# EAGLE design mika (EAGLE 7.7.0)
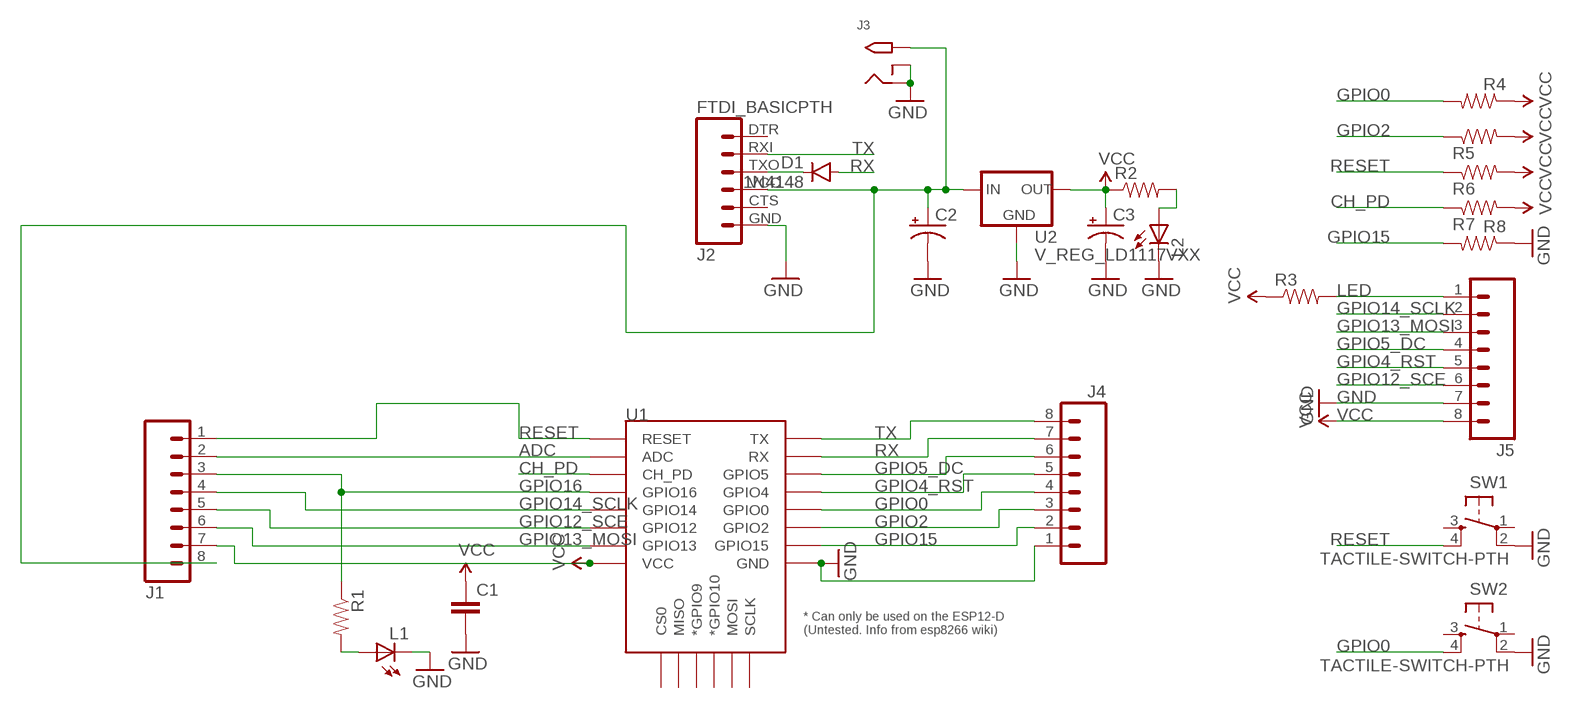
[diagram p0: schematic, sheet 1]

## Parts
C1  CAPKIT  [CAP-PTH-SMALL-KIT]
C2  CAP_POLPTH2  [CPOL-RADIAL-10UF-25V]
C3  CAP_POLPTH2  [CPOL-RADIAL-10UF-25V]
D1  1N4148  DIODE1N4148  [DIODE-1N4148]
J1  M083.5MM-8  [SCREWTERMINAL-3.5MM-8]
J2  FTDI_BASICPTH  [FTDI_BASIC]
J3  2.1MMJACKTHM  [PJ-102A]
J4  M083.5MM-8  [SCREWTERMINAL-3.5MM-8]
J5  M08  [1X08_ROUND]
L1  LED5MM  [LED5MM]
L2  LED5MM  [LED5MM]
R1  RESISTORKIT  [AXIAL-0.3-KIT]
R2  RESISTORKIT  [AXIAL-0.3-KIT]
R3  RESISTORKIT  [AXIAL-0.3-KIT]
R4  RESISTORKIT  [AXIAL-0.3-KIT]
R5  RESISTORKIT  [AXIAL-0.3-KIT]
R6  RESISTORKIT  [AXIAL-0.3-KIT]
R7  RESISTORKIT  [AXIAL-0.3-KIT]
R8  RESISTORKIT  [AXIAL-0.3-KIT]
SW1  TACTILE-SWITCH-PTH  [TAC-SWITCH-PTH]
SW2  TACTILE-SWITCH-PTH  [TAC-SWITCH-PTH]
U1  ESP12ESMD  [ESP12E-SMD]
U2  V_REG_LD1117VXX  [78XXL]

## Nets
ADC: J1.2 U1.ADC
CH_PD: R7.P$1 U1.CH_PD
GND: C1.2 C2.2(-) C3.2(-) J2.GND J3.RING J3.RING_SW J4.1 J5.7 L1.K(C) L2.K(C) R8.P$1 SW1.2 SW2.2 U1.GND U2.GND
GPIO0: J4.4 R4.P$2 SW2.4 U1.GPIO0
GPIO2: J4.3 R5.P$1 U1.GPIO2
GPIO4_RST: J4.5 J5.5 U1.GPIO4
GPIO5_DC: J4.6 J5.4 U1.GPIO5
GPIO12_SCE: J1.5 J5.6 U1.GPIO12
GPIO13_MOSI: J1.6 J5.3 U1.GPIO13
GPIO14_SCLK: J1.4 J5.2 U1.GPIO14
GPIO15: J4.2 R8.P$2 U1.GPIO15
GPIO16: J1.3 R1.P$1 U1.GPIO16
LED: J5.1 R3.P$2
N$1: D1.C J2.TXO
N$2: C2.1(+) J1.8 J2.VCC J3.TIP U2.IN
N$3: L2.A R2.P$2
N$4: L1.A R1.P$2
RESET: J1.1 R6.P$1 SW1.4 U1.RESET
RX: D1.A J4.7 U1.RXD0(RX)
TX: J2.RXI J4.8 U1.TXD0(TX)
VCC: C1.1 C3.1(+) J1.7 J5.8 R2.P$1 R3.P$1 R4.P$1 R5.P$2 R6.P$2 R7.P$2 U1.VCC U2.OUT
Unconnected: J2.CTS J2.DTR SW1.1 SW1.3 SW2.1 SW2.3 U1.CS0 U1.GPIO9(*GPIO9) U1.GPIO10(*GPIO10) U1.MISO U1.MOSI U1.SCLK

## Library data of the parts
C1 = SparkFun-Capacitors:CAP: Capacitor Standard 0603 ceramic capacitor, and 0.1" leaded capacitor.
C2 C3 = SparkFun-Passives:CAP_POL: Capacitor Polarized These are standard SMD and PTH capacitors. Normally 10uF, 47uF, and 100uF in electrolytic and tantalum varieties. Always verify the external diameter of the through hole cap, it varies with capacity, voltage, and manufacturer. The EIA devices should be standard.
D1 = SparkFun-DiscreteSemi:DIODE: Diode These are standard reverse protection diodes and small signal diodes. SMA package can handle up to about 1A. SOD-323 can handle about 200mA. What the SOD-323 package when ordering, there are some mfgs out there that are 5-pin packages.; PROD_ID: DIO-08378
J1 J4 = SparkFun-Connectors:M08: Header 8 Standard 8-pin 0.1" header. Use with straight break away headers (SKU : PRT-00116), right angle break away headers (PRT-00553), swiss pins (PRT-00743), machine pins (PRT-00117), and female headers (PRT-00115).
J2 = SparkFun-Connectors:FTDI_BASIC: FTDI Basic header with labels
J3 = adafruit:2.1MMJACK: 2.1mm x 5.5mm THM DC jack with internal switch. Digikey part #PJ-102A, 4UCON part #05537 2.1mm x 5.5mm SMT DC jack with internal switch. Digikey part #PJ-002A-SMT, 4UCON part #03267 By microbuilder.eu & adafruit.com
J5 = SparkFun-Connectors:M08: Header 8 Standard 8-pin 0.1" header. Use with straight break away headers (SKU : PRT-00116), right angle break away headers (PRT-00553), swiss pins (PRT-00743), machine pins (PRT-00117), and female headers (PRT-00115).; PROD_ID: CONN-08437
L1 L2 = adafruit:LED: LED OSRAM: - CHIPLED LG R971, LG N971, LY N971, LG Q971, LY Q971, LO R971, LY R971 LH N974, LH R974 LS Q976, LO Q976, LY Q976 LO Q996 - Hyper CHIPLED LW Q18S LB Q993, LB Q99A, LB R99A - SideLED LS A670, LO A670, LY A670, LG A670, LP A670 LB A673, LV A673, LT A673, LW A673 LH A674 LY A675 LS A676, LA A676, LO A676, LY A676, LW A676 LS A679, LY A679, LG A679 - Hyper Micro SIDELED® LS Y876, LA Y876, LO Y876, LY Y876 LT Y87S - SmartLED LW L88C, LW L88S LB L89C, LB L89S, LG L890 LS L89K, LO L89K, LY L89K LS L896, LA L896, LO L896, LY L896 - TOPLED LS T670, LO T670, LY T670, LG T670, LP T670 LSG T670, LSP T670, LSY T670, LOP T670, LYG T670 LG T671, LOG T671, LSG T671 LB T673, LV T673, LT T673, LW T673 LH T674 LS T676, LA T676, LO T676, LY T676, LB T676, LH T676, LSB T676, LW T676 LB T67C, LV T67C, LT T67C, LS T67K, LO T67K, LY T67K, LW E67C LS E67B, LA E67B, LO E67B, LY E67B, LB E67C, LV E67C, LT E67C LW T67C LS T679, LY T679, LG T679 LS T770, LO T770, LY T770, LG T770, LP T770 LB T773, LV T773, LT T773, LW T773 LH T774 LS E675, LA E675, LY E675, LS T675 LS T776, LA T776, LO T776, LY T776, LB T776 LHGB T686 LT T68C, LB T68C - Hyper Mini TOPLED® LB M676 - Mini TOPLED Santana® LG M470 LS M47K, LO M47K, LY M47K Source: http://www.osram.convergy.de/
R1-R8 = SparkFun-Resistors:RESISTOR: Resistor Basic schematic elements and footprints for 0603, 1206, and PTH resistors.
SW1 SW2 = GeekAmmo:TACTILE-SWITCH: Tactile Switch 4 Pins, SPST NO
U1 = esp8266modules:ESP12E: ESP12E Module
U2 = SparkFun-PowerIC:V_REG_LD1117VXX: LD1117VXX voltage regulator. We carry the 3.3V version (COM-00526) in TO-220 package.

## Board
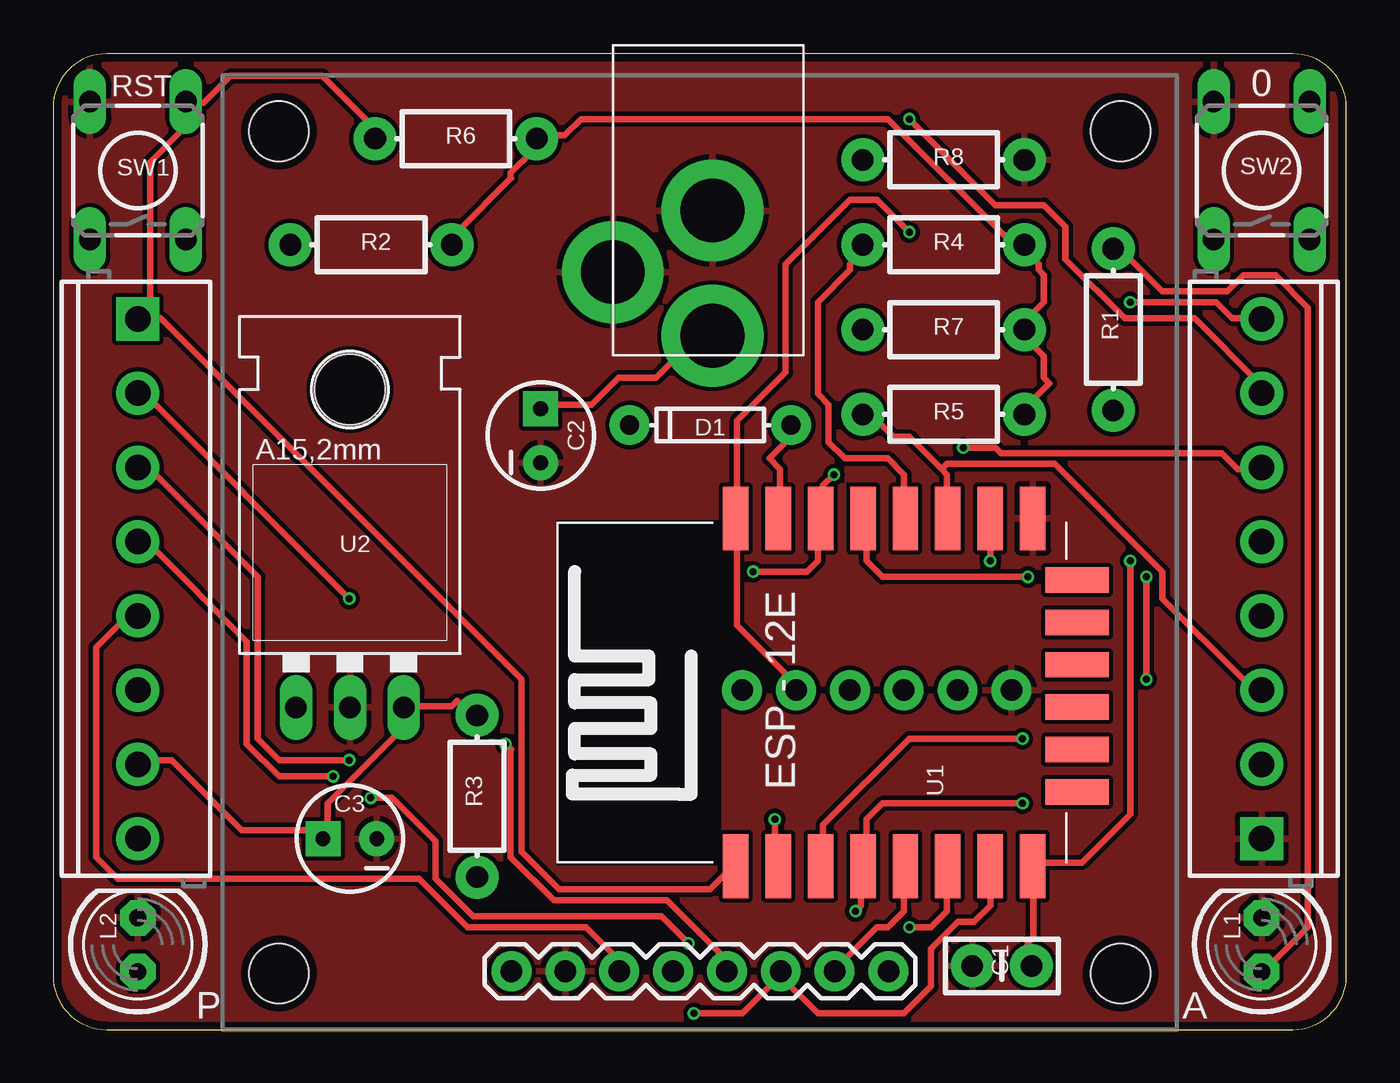
[diagram p1: board, top side]
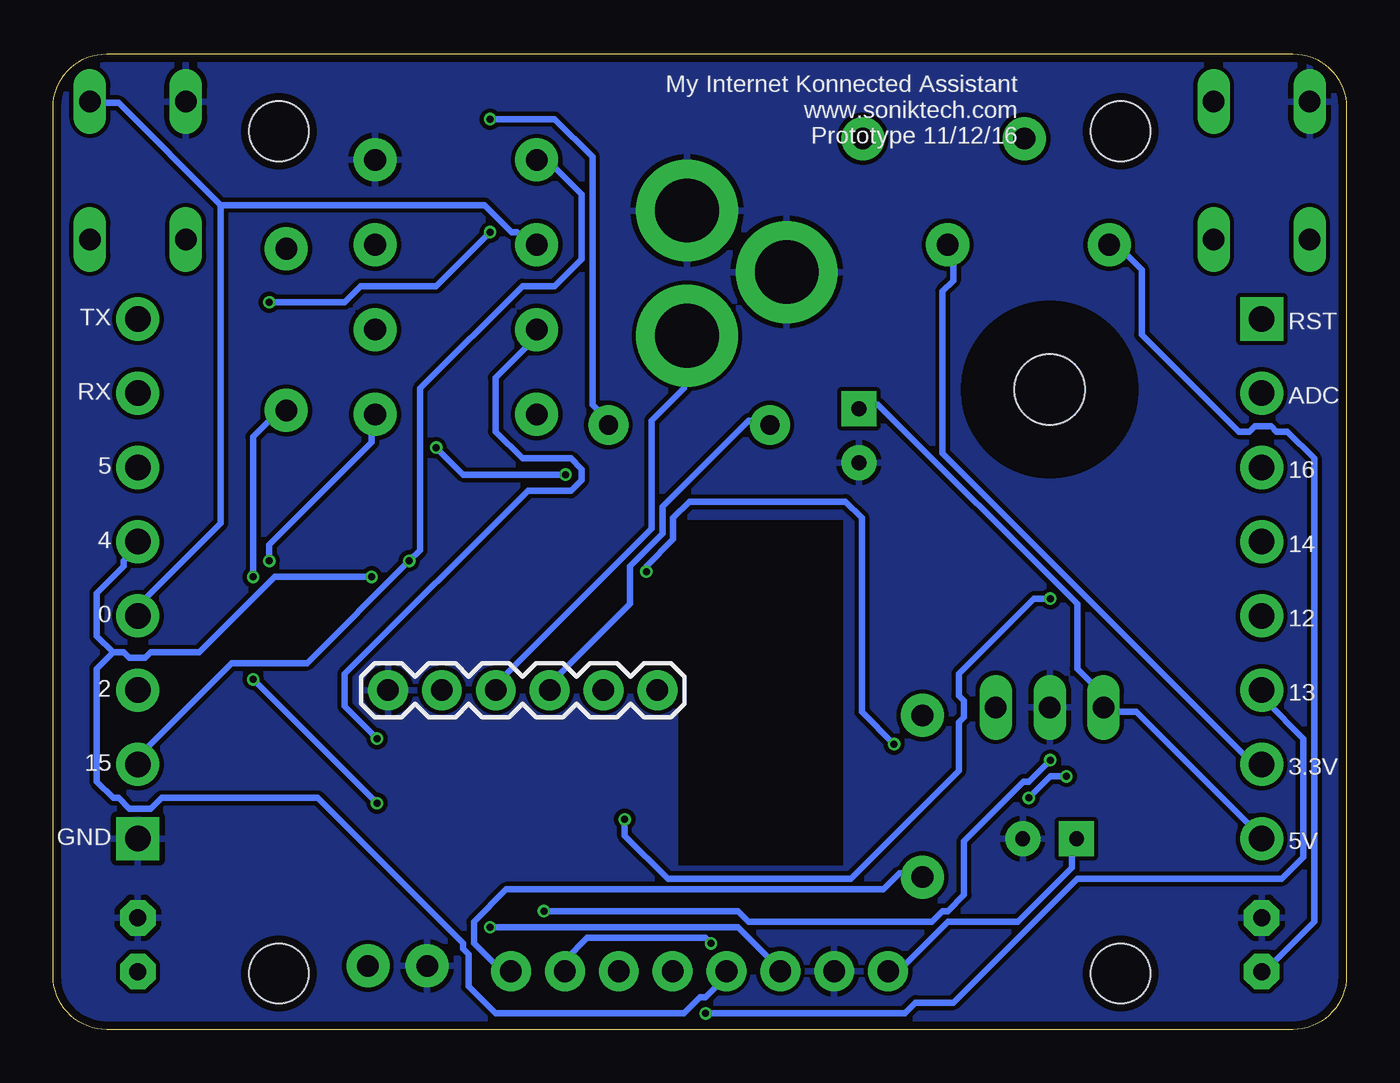
[diagram p2: board, bottom side, seen from below]

Size 61 x 46 mm. Coordinates in mm from the lower left corner, seen from the top.
Outline: 0,43.46 0,2.54 arc90 2.54,0 58.46,0 arc90 61,2.54 61,43.46 arc90 58.46,46 2.54,46 arc90 0,43.46
Copper layers (1*16): Top 0.0356mm / dielectric 1.5011mm / Bottom 0.0356mm
Design rules "OSHparkDruTented8mil *": minimum track width 12mil, minimum drill 13mil, track to track 8mil, track to pad 8mil, pad to pad 8mil, via to via 8mil, smd to smd 5mil, copper to edge 15mil, drill to drill 6mil, minimum pad ring 5mil, minimum via ring 5mil, stop-mask expansion 3mil, vias tented up to drill 14mil, thermal gap 10mil
Holes 2.8 mm at 10.65,2.65 50.35,2.65 50.35,42.35 10.65,42.35
tRestrict: area 23.8,7.8 to 31.5,24
bRestrict: area 23.8,7.8 to 31.5,24

### Footprints (pad centres in the part's own frame; a part is rotated, then mirrored left to right if it is on the bottom)
CAP-PTH-SMALL-KIT = drill 1.016 pad 2.032: 1 -1.397,0; 2 1.397,0
CPOL-RADIAL-10UF-25V = drill 0.7 pad 1.651 square: 1 1.27,0 | drill 0.7 pad 1.651: 2 -1.27,0
DIODE-1N4148 = drill 0.9 pad 1.88: A -3.81,0; C 3.81,0
SCREWTERMINAL-3.5MM-8 = drill 1.2 pad 2.032 square: 1 0,0 | drill 1.2 pad 2.032: 2 3.5,0; 3 7,0; 4 10.5,0; 5 14,0; 6 17.5,0; 7 21,0; 8 24.5,0
FTDI_BASIC = drill 1.016 pad 1.88: CTS 10.16,0; DTR 0,0; GND 12.7,0; RXI 2.54,0; TXO 5.08,0; VCC 7.62,0
PJ-102A = drill 3 pad 4.8: RING 0.1,-3.39; RING_SW -4.6,-6.29; TIP 0.1,-9.29
1X08_ROUND = drill 1.016 pad 1.88: 1 0,0; 2 2.54,0; 3 5.08,0; 4 7.62,0; 5 10.16,0; 6 12.7,0; 7 15.24,0; 8 17.78,0
LED5MM = drill 0.813 pad 1.676 octagon: A -1.27,0; K 1.27,0
AXIAL-0.3-KIT = drill 1.016 pad 2.032: P$1 -3.81,0; P$2 3.81,0
TAC-SWITCH-PTH = drill 1.016 pad 1.524 long: 1 -3.251,2.261; 2 3.251,2.261; 3 -3.251,-2.261; 4 3.251,-2.261
ESP12E-SMD = smd 3 x 1.2: ADC -8.3,3.8; CH_PD -8.3,1.8; GND 8.1,-8.2; GPIO0 8.1,-2.2; GPIO2 8.1,-4.2; GPIO4 8.1,-0.2; GPIO5 8.1,1.8; GPIO12 -8.3,-4.2; GPIO13 -8.3,-6.2; GPIO14 -8.3,-2.2; GPIO15 8.1,-6.2; GPIO16 -8.3,-0.2; RESET -8.3,5.8; RXD0 8.1,3.8; TXD0 8.1,5.8; VCC -8.3,-8.2 | smd 1.2 x 3: CS0 -4.8,-10.3; GPIO9 -0.8,-10.3; GPIO10 1.2,-10.3; MISO -2.8,-10.3; MOSI 3.2,-10.3; SCLK 5.2,-10.3
78XXL = drill 1.016 long: GND 0,-3.81; IN -2.54,-3.81; OUT 2.54,-3.81 | hole 3.302: 0,11.176

### Placement (x,y rotation side)
C1  44.75,3 180 top
C2  23,28 90 top
C3  14,9 180 top
D1  31,28.5 180 top
J1  4,33.5 270 top
J2  32.5,16 180 bottom
J3  31,42 0 top
J4  57,9 90 top
J5  39.4,2.75 180 top
L1  57,4 90 top
L2  4,4 90 top
R1  50,33 90 top
R2  15,37 180 top
R3  20,11 270 top
R4  42,37 180 top
R5  42,29 0 top
R6  19,42 0 top
R7  42,33 0 top
R8  42,41 180 top
SW1  4,40.5 90 top
SW2  57,40.5 90 top
U1  38,16 90 top
U2  14,19 0 top

### Tracks (layer width: path | path; a pad name or v marks a point on that pad's centre or on a via)
ADC  (via drill 0.33)
  Top 0.305: v34.04,9.91 34.04,7.87 U1.ADC | v13.97,20.32 4.06,30.23 J1.2
  Bottom 0.305: v34.04,9.91 34.04,9.14 32,7.11 23.37,7.11 18.29,12.19 18.29,14.48 18.03,14.73 18.03,15.49 18.29,15.75 18.29,16.76 14.73,20.32 v13.97,20.32
CH_PD  (via drill 0.33)
  Top 0.305: v45.72,13.72 40.39,13.72 36.32,9.65 36.32,7.87 U1.CH_PD
  Bottom 0.305: v45.72,13.72 47.24,15.24 47.24,16.76 38.61,25.4 36.58,25.4 36.07,25.91 36.07,26.42 36.58,26.92 38.86,26.92 40.13,28.19 40.13,30.73 38.1,32.77 R7.P$1
GND
  pour Bottom: 0,46 61,46 61,0 0,0
  pour Top: 0,46 61,46 61,0 0,0
GPIO0
  Top 0.305: U1.GPIO0 40.13,24.13 40.13,26.16 39.37,26.92 37.34,26.92 36.58,27.69 36.58,29.46 36.07,29.97 36.07,34.29 37.59,35.81 37.59,36.07 38.35,36.83 R4.P$2
  Bottom 0.305: 53.09,38.86 57.91,43.69 59.18,43.69 SW2.4 | 53.09,38.86 40.64,38.86 39.37,37.59 39.12,37.59 38.35,36.83 R4.P$2 | 53.09,38.86 53.09,23.88 56.9,20.07 56.9,19.56 J4.4
GPIO2
  Top 0.305: 41.91,26.42 40.39,27.94 39.62,27.94 38.35,29.21 R5.P$1 | 41.91,26.42 42.16,26.16 42.16,24.13 U1.GPIO2 | 41.91,26.42 42.16,26.67 47.24,26.67 52.32,21.59 52.32,20.32 56.13,16.51 56.39,16.51 56.9,16 J4.3
GPIO4_RST  (via drill 0.33)
  Top 0.305: v45.97,21.34 39.12,21.34 38.35,22.1 38.35,23.88 U1.GPIO4
  Bottom 0.305: v45.97,21.34 50.55,21.34 54.1,17.78 56.39,17.78 56.64,17.53 57.4,17.53 57.66,17.78 58.17,17.78 | 58.17,17.78 58.93,18.54 58.93,20.57 57.66,21.84 57.66,22.1 56.9,22.86 J4.5 | 58.17,17.78 58.93,17.02 58.93,11.68 58.17,10.92 57.91,10.92 57.4,10.41 56.39,10.41 55.88,10.92 48.51,10.92 41.66,4.06 41.66,3.81 41.4,3.56 41.4,2.03 40.13,0.76 31.24,0.76 30.48,1.52 30.23,1.52 29.46,2.29 29.46,2.54 J5.5
GPIO5_DC  (via drill 0.33)
  Top 0.305: v36.83,26.16 36.32,25.65 36.32,24.13 U1.GPIO5 36.07,23.88 36.07,22.1 35.56,21.59 v33.02,21.59 | v42.93,27.43 44.45,27.43 44.7,27.18 55.12,27.18 55.88,26.42 56.9,26.42 J4.6 | v21.34,13.46 21.59,13.21 21.59,8.13 23.62,6.1 28.96,6.1 31.75,3.3 31.75,2.79 J5.4
  Bottom 0.305: v36.83,26.16 41.66,26.16 v42.93,27.43 | v21.34,13.46 22.86,14.99 22.86,24.13 23.62,24.89 30.99,24.89 31.75,24.13 31.75,23.11 33.02,21.84 v33.02,21.59
GPIO12_SCE  (via drill 0.33)
  Top 0.305: v40.39,4.83 41.4,4.83 42.16,5.59 42.16,7.62 U1.GPIO12 | J1.5 3.81,19.3 3.3,19.3 2.03,18.03 2.03,8.13 3.05,7.11 17.27,7.11 19.56,4.83 25.15,4.83 26.67,3.3 26.67,2.79 J5.6
  Bottom 0.305: v40.39,4.83 28.7,4.83 26.67,2.79 J5.6
GPIO13_MOSI  (via drill 0.33)
  Top 0.305: 34.29,2.54 36.07,0.76 40.13,0.76 41.4,2.03 41.4,3.81 42.67,5.08 43.43,5.08 44.2,5.84 44.2,7.62 U1.GPIO13 | v30.23,0.76 32.51,0.76 34.29,2.54 | 34.29,2.54 J5.3
  Bottom 0.305: v30.23,0.76 20.83,0.76 20.32,1.27 18.54,1.27 12.7,7.11 3.05,7.11 2.03,8.13 2.03,13.72 3.81,15.49 3.81,15.75 J1.6
GPIO14_SCLK  (via drill 0.33)
  Top 0.305: U1.GPIO14 40.13,7.62 40.13,5.59 39.37,4.83 38.86,4.83 36.83,2.79 J5.2 | v13.21,11.94 10.67,11.94 9.14,13.46 9.14,18.29 4.57,22.86 4.06,22.86 J1.4 | v14.99,10.92 16,10.92 18.03,8.89 18.03,7.11 19.81,5.33 28.7,5.33 v29.97,4.06
  Bottom 0.305: v13.21,11.94 13.97,11.94 v14.99,10.92 | v29.97,4.06 30.23,4.32 35.81,4.32 36.83,3.3 36.83,2.79 J5.2
GPIO15  (via drill 0.33)
  Top 0.305: v44.2,22.1 44.2,23.88 U1.GPIO15
  Bottom 0.305: J4.2 57.15,12.7 52.58,17.27 49.02,17.27 v44.2,22.1 43.69,22.61 43.69,30.23 38.86,35.05 37.34,35.05 36.07,36.32 36.07,39.37 37.59,40.89 38.1,40.89 R8.P$2
GPIO16  (via drill 0.33)
  Top 0.305: v45.72,10.67 39.12,10.67 38.35,9.91 38.35,7.87 U1.GPIO16 38.1,7.62 38.1,5.84 v37.85,5.59 | v51.56,21.34 v51.56,16.51 | v13.97,12.7 10.67,12.7 9.65,13.72 9.65,21.34 4.57,26.42 4.06,26.42 J1.3
  Bottom 0.305: v51.56,16.51 v45.72,10.67 | v51.56,21.34 51.56,27.94 50.55,28.96 50.04,28.96 R1.P$1 | v13.97,12.7 14.99,11.68 15.24,11.68 18.03,8.89 18.03,6.35 18.8,5.59 19.05,5.59 19.56,5.08 28.19,5.08 28.7,5.59 v37.85,5.59
LED
  Bottom 0.305: J5.1 39.62,2.79 39.88,2.79 41.15,4.06 41.15,5.08 39.62,6.6 21.84,6.6 21.08,7.37 20.07,7.37 R3.P$2
N$1
  Bottom 0.305: J2.TXO 37.34,16 37.34,16.51 33.78,20.07 33.78,21.84 32.26,23.37 32.26,24.64 28.19,28.7 27.43,28.7 D1.C
N$2
  Top 0.305: C2.1 23.11,29.46 25.4,29.46 26.67,30.73 28.45,30.73 30.23,32.51 30.99,32.51 J3.TIP
  Bottom 0.305: J1.8 4.06,9.14 9.91,14.99 11.43,14.99 U2.IN 11.68,15.24 11.68,16 12.7,17.02 12.7,20.07 22.1,29.46 22.86,29.46 C2.1 | J2.VCC 39.88,16 39.88,16.51 32.77,23.62 32.77,28.7 31.24,30.23 31.24,32.51 J3.TIP
N$3
  Bottom 0.305: L2.A 3.81,2.79 1.52,5.08 1.52,26.92 2.79,28.19 3.3,28.19 3.56,28.45 4.32,28.45 4.57,28.19 5.08,28.19 9.65,32.77 9.65,35.81 10.67,36.83 11.18,36.83 R2.P$2
N$4
  Top 0.305: L1.A 57.15,2.79 59.18,4.83 59.18,34.04 57.66,35.56 56.13,35.56 55.37,34.8 52.32,34.8 50.55,36.58 50.04,36.58 R1.P$2
RESET
  Top 0.305: 4.57,33.53 4.06,33.53 J1.1 4.57,33.53 | 4.57,33.53 5.08,33.53 22.1,16.51 22.1,8.38 23.88,6.6 30.99,6.6 32,7.62 U1.RESET | 4.57,33.53 4.57,40.89 6.1,42.42 6.1,43.69 SW1.4 6.35,43.69 7.11,43.69 8.38,44.96 12.7,44.96 14.99,42.67 14.99,42.16 R6.P$1
RX  (via drill 0.33)
  Top 0.305: U1.RXD0 34.29,24.13 34.29,26.42 33.78,26.92 34.8,27.94 34.8,28.45 D1.A | v40.39,42.93 44.45,38.86 46.74,38.86 47.75,37.85 47.75,36.32 50.55,33.53 53.85,33.53 56.9,30.48 56.9,30.23 J4.7
  Bottom 0.305: v40.39,42.93 37.34,42.93 35.56,41.15 35.56,29.46 34.8,28.7 D1.A
TX  (via drill 0.33)
  Top 0.305: J2.RXI 34.8,16 34.8,16.51 32.26,19.05 32.26,23.88 U1.TXD0 32.26,24.13 32.26,28.7 34.54,30.99 34.54,36.07 37.59,39.12 38.86,39.12 v40.39,37.59 | v50.8,34.29 54.86,34.29 55.63,33.53 56.9,33.53 J4.8
  Bottom 0.305: v50.8,34.29 47.24,34.29 46.48,35.05 42.93,35.05 v40.39,37.59
VCC  (via drill 0.33)
  Top 0.305: R3.P$1 19.81,14.73 19.05,15.49 18.8,15.24 16.76,15.24 U2.OUT 16.51,14.99 16.51,14.22 12.95,10.67 12.95,9.4 | 12.95,9.4 12.95,9.14 C3.1 12.95,9.4 | 12.95,9.4 8.89,9.4 5.59,12.7 4.06,12.7 J1.7 | R2.P$1 19.05,37.08 19.05,37.59 21.59,40.13 21.59,40.39 22.61,41.4 22.61,41.91 R6.P$2 22.86,42.16 24.13,42.16 24.89,42.93 39.37,42.93 45.21,37.08 45.72,37.08 R4.P$1 45.97,36.83 45.97,36.58 46.48,36.07 46.48,35.81 46.74,35.56 46.74,34.29 45.97,33.53 45.97,33.02 R7.P$2 45.72,32.77 46.74,31.75 46.74,30.73 46.99,30.48 45.97,29.46 45.97,29.21 R5.P$2 | C1.1 45.97,3.05 45.97,4.06 46.23,4.32 46.23,7.62 U1.VCC 46.23,7.87 48.51,7.87 50.8,10.16 v50.8,22.1
  Bottom 0.305: J5.8 21.59,2.79 21.08,2.79 18.8,5.08 15.49,5.08 12.95,7.62 12.95,8.89 C3.1 | v50.8,22.1 50.8,22.86 45.97,27.69 45.97,28.96 R5.P$2 | J1.7 4.06,12.7 4.57,12.7 19.05,27.18 19.05,34.8 18.54,35.31 18.54,36.58 18.8,36.83 R2.P$1

### Text on the board
tNames: RST | 0 | P | A
bNames: My Internet Konnected Assistant / www.soniktech.com / Prototype 11/12/16 | TX | RST | ADC | RX | 5 | 16 | 4 | 14 | 0 | 12 | 13 | 2 | 15 | 3.3V | GND | 5V